# EAGLE schematic main (EAGLE 9.5.0)
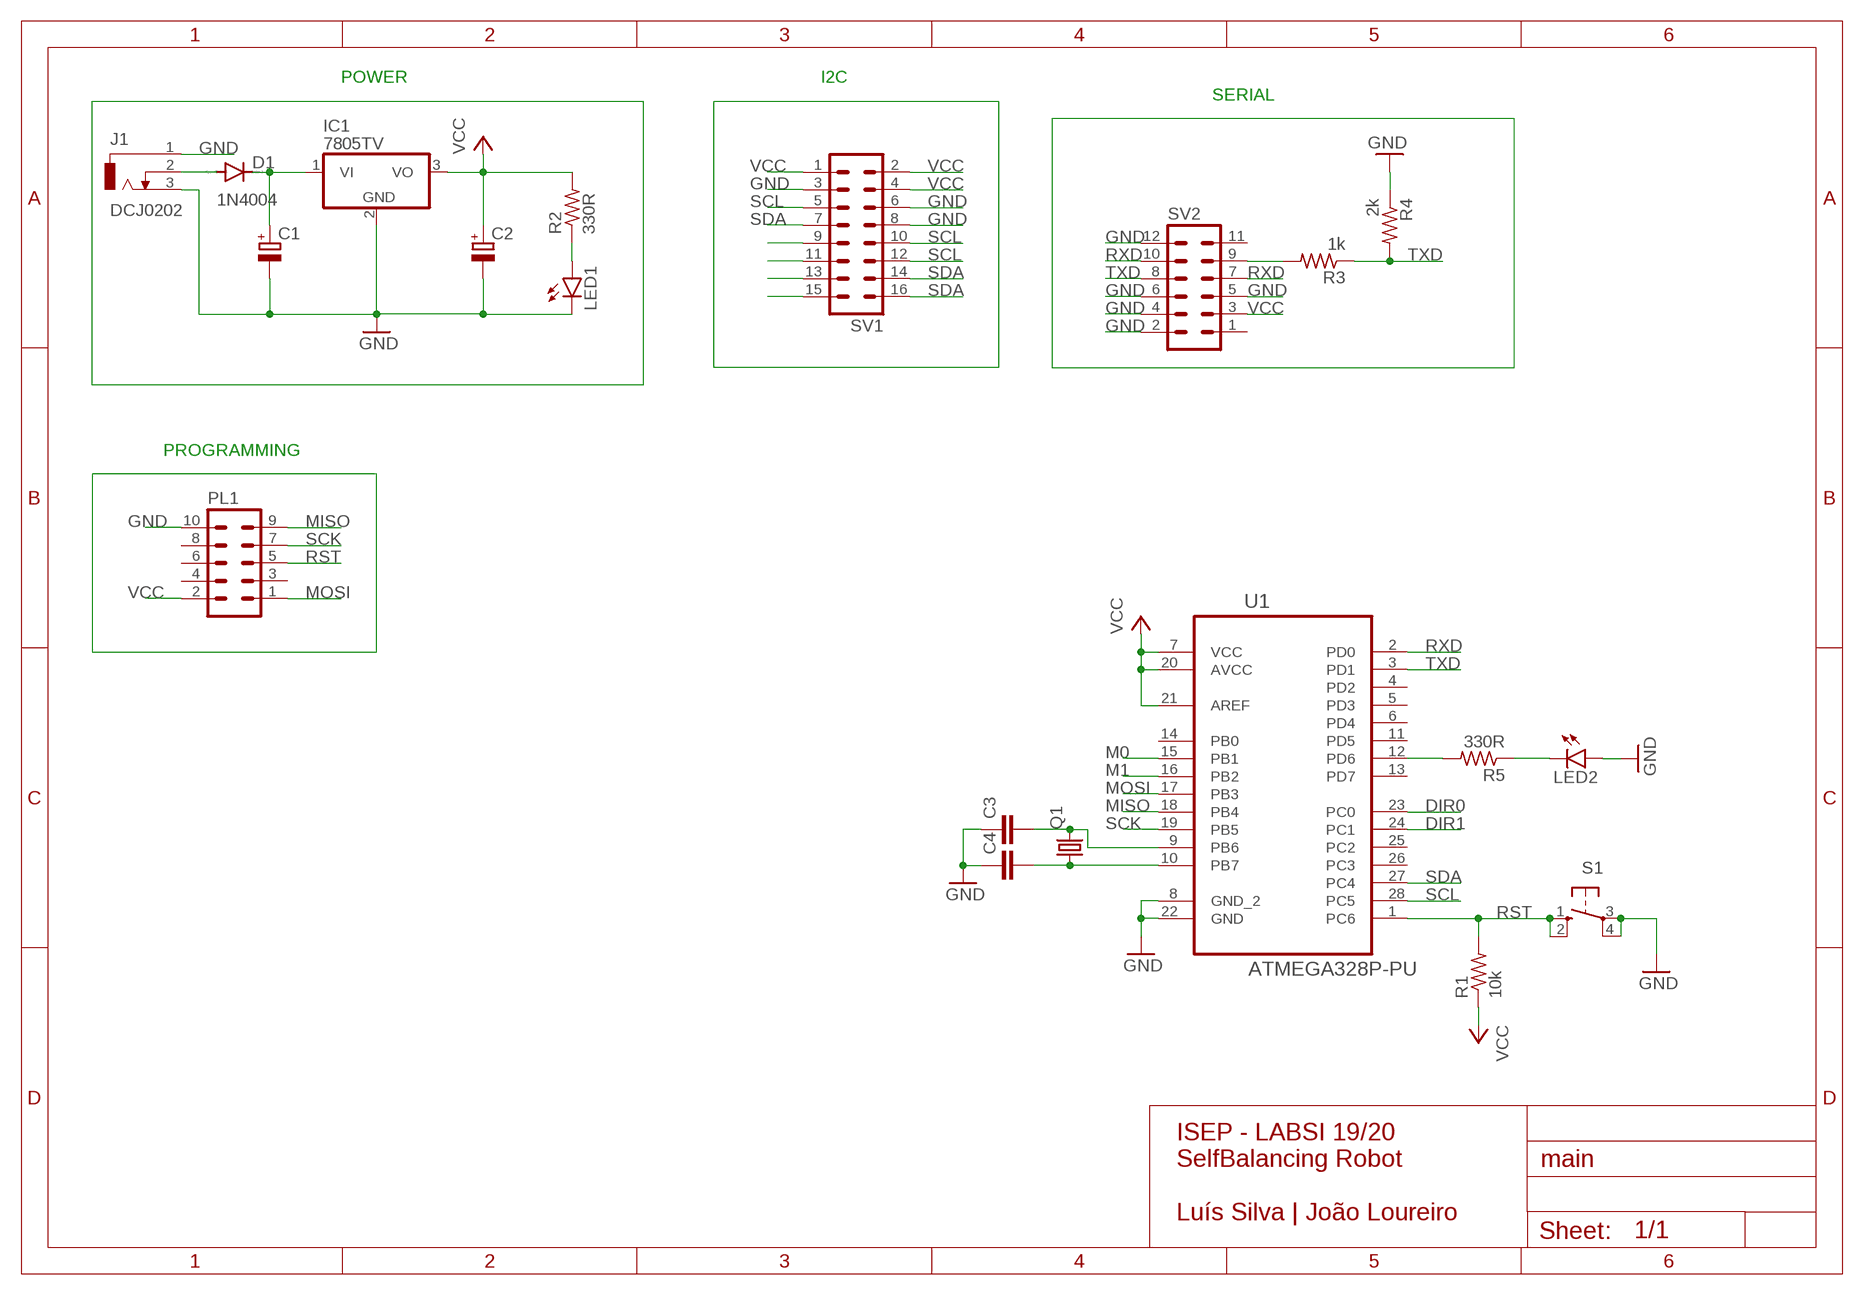
[diagram p0: schematic, sheet 1]

## Parts
C1  CPOL-EUB45181A  [B45181A]
C2  CPOL-EUB45181A  [B45181A]
C3  C5/3  [C5B3]
C4  C5/3  [C5B3]
D1  1N4004  [DO41-10]
IC1  7805TV  [TO220V]
J1  DCJ0202  [DCJ0202]
LED1  LED3MM  [LED3MM]
LED2  LED3MM  [LED3MM]
PL1  10H  [10H]
Q1  CRYSTALHC49S  [HC49/S]
R1  10k  R-US_0207/10  [0207/10]
R2  330R  R-US_0207/10  [0207/10]
R3  1k  R-US_0207/10  [0207/10]
R4  2k  R-US_0207/10  [0207/10]
R5  330R  R-US_0207/10  [0207/10]
S1  10-XX  [B3F-10XX]
SV1  MA08-2  [MA08-2]
SV2  MA06-2  [MA06-2]
U1  ATMEGA328P-PU  [DIP254P762X457-28]

## Nets
DIR0: U1.23(PC0)
DIR1: U1.24(PC1)
GND: C1.- C2.- C3.1 C4.1 IC1.2(GND) J1.1 J1.3 LED1.K(C) LED2.A PL1.10 R4.1 S1.3(P) S1.4(P1) SV1.3 SV1.6 SV1.8 SV2.2 SV2.4 SV2.5 SV2.6 SV2.12 U1.8(GND_2) U1.22(GND)
M0: U1.15(PB1)
M1: U1.16(PB2)
MISO: PL1.9 U1.18(PB4)
MOSI: PL1.1 U1.17(PB3)
N$1: C1.+ D1.C IC1.1(VI)
N$2: LED1.A R2.1
N$5: D1.A J1.2
N$6: C4.2 Q1.1 U1.10(PB7)
N$7: C3.2 Q1.2 U1.9(PB6)
N$9: R3.2 SV2.9
N$11: LED2.K(C) R5.1
N$12: SV1.9
N$13: SV1.11
N$14: SV1.13
N$15: SV1.15
N$16: R5.2 U1.12(PD6)
RST: PL1.5 R1.2 S1.1(S) S1.2(S1) U1.1(PC6)
RXD: SV2.7 SV2.10 U1.2(PD0)
SCK: PL1.7 U1.19(PB5)
SCL: SV1.5 SV1.10 SV1.12 U1.28(PC5)
SDA: SV1.7 SV1.14 SV1.16 U1.27(PC4)
TXD: R3.1 R4.2 SV2.8 U1.3(PD1)
VCC: C2.+ IC1.3(VO) PL1.2 R1.1 R2.2 SV1.1 SV1.2 SV1.4 SV2.3 U1.7(VCC) U1.20(AVCC) U1.21(AREF)
Unconnected: PL1.3 PL1.4 PL1.6 PL1.8 SV2.1 SV2.11 U1.4(PD2) U1.5(PD3) U1.6(PD4) U1.11(PD5) U1.13(PD7) U1.14(PB0) U1.25(PC2) U1.26(PC3)

## Notes on the sheet
- POWER | I2C
- SERIAL
- PROGRAMMING
- ISEP - LABSI 19/20
  SelfBalancing Robot
  
  Luís Silva | João Loureiro

## Library data of the parts
C1 C2 = rcl:CPOL-EU: POLARIZED CAPACITOR, European symbol; SPICEPREFIX: C
C3 C4 = capacitor-wima:C: CAPACITOR naming: grid - package width
D1 = diode:1N4004: DIODE general purpose rectifier, 1 A
IC1 = linear:78*: Positive VOLTAGE REGULATOR Source: http://cache.national.com/ds/LM/LM78L05.pdf http://www.fairchildsemi.com/ds/LM/LM7805.pdf
J1 = con-jack:DCJ0202: DC POWER JACK Source: DCJ0202.pdf; OC_FARNELL: unknown; OC_NEWARK: unknown
LED1 LED2 = led:LED: LED OSRAM: - CHIPLED LG R971, LG N971, LY N971, LG Q971, LY Q971, LO R971, LY R971 LH N974, LH R974 LS Q976, LO Q976, LY Q976 LO Q996 - Hyper CHIPLED LW Q18S LB Q993, LB Q99A, LB R99A - SideLED LS A670, LO A670, LY A670, LG A670, LP A670 LB A673, LV A673, LT A673, LW A673 LH A674 LY A675 LS A676, LA A676, LO A676, LY A676, LW A676 LS A679, LY A679, LG A679 - Hyper Micro SIDELED® LS Y876, LA Y876, LO Y876, LY Y876 LT Y87S - SmartLED LW L88C, LW L88S LB L89C, LB L89S, LG L890 LS L89K, LO L89K, LY L89K LS L896, LA L896, LO L896, LY L896 - TOPLED LS T670, LO T670, LY T670, LG T670, LP T670 LSG T670, LSP T670, LSY T670, LOP T670, LYG T670 LG T671, LOG T671, LSG T671 LB T673, LV T673, LT T673, LW T673 LH T674 LS T676, LA T676, LO T676, LY T676, LB T676, LH T676, LSB T676, LW T676 LB T67C, LV T67C, LT T67C, LS T67K, LO T67K, LY T67K, LW E67C LS E67B, LA E67B, LO E67B, LY E67B, LB E67C, LV E67C, LT E67C LW T67C LS T679, LY T679, LG T679 LS T770, LO T770, LY T770, LG T770, LP T770 LB T773, LV T773, LT T773, LW T773 LH T774 LS E675, LA E675, LY E675, LS T675 LS T776, LA T776, LO T776, LY T776, LB T776 LHGB T686 LT T68C, LB T68C - Hyper Mini TOPLED® LB M676 - Mini TOPLED Santana® LG M470 LS M47K, LO M47K, LY M47K Source: http://www.osram.convergy.de LUXEON: - LUMILED® LXK2-PW12-R00, LXK2-PW12-S00, LXK2-PW14-U00, LXK2-PW14-V00 LXK2-PM12-R00, LXK2-PM12-S00, LXK2-PM14-U00 LXK2-PE12-Q00, LXK2-PE12-R00, LXK2-PE12-S00, LXK2-PE14-T00, LXK2-PE14-U00 LXK2-PB12-K00, LXK2-PB12-L00, LXK2-PB12-M00, LXK2-PB14-N00, LXK2-PB14-P00, LXK2-PB14-Q00 LXK2-PR12-L00, LXK2-PR12-M00, LXK2-PR14-Q00, LXK2-PR14-R00 LXK2-PD12-Q00, LXK2-PD12-R00, LXK2-PD12-S00 LXK2-PH12-R00, LXK2-PH12-S00 LXK2-PL12-P00, LXK2-PL12-Q00, LXK2-PL12-R00 Source: www.luxeon.com KINGBRIGHT: KA-3528ASYC Source: www.kingbright.com
PL1 = con-harting-h:10H: CONNECTOR; OC_FARNELL: unknown; OC_NEWARK: unknown
Q1 = crystal:CRYSTAL: CRYSTAL; OC_FARNELL: 1667008; OC_NEWARK: unknown
R1-R5 = resistor:R-US_: RESISTOR, American symbol
S1 = switch-omron:10-XX: OMRON SWITCH; MPN: B3F-1000; OC_FARNELL: 176432; OC_NEWARK: 36M3542
SV1 = con-lstb:MA08-2: PIN HEADER; OC_FARNELL: unknown; OC_NEWARK: unknown
SV2 = con-lstb:MA06-2: PIN HEADER; OC_FARNELL: unknown; OC_NEWARK: unknown
U1 = ATMEGA328P-PU:ATMEGA328P-PU: 8-bit Microcontroller with In-System Programmable Flash; AVAILABILITY: Unavailable; DESCRIPTION: 1 Pack ATmega328P-PU DIP-28 Chip with; MF: Generic; MP: ATMEGA328P-PU; PACKAGE: DIP-28 Generic; PRICE: None